# Altium schematic sheet TPS40057.SchDoc
size A3
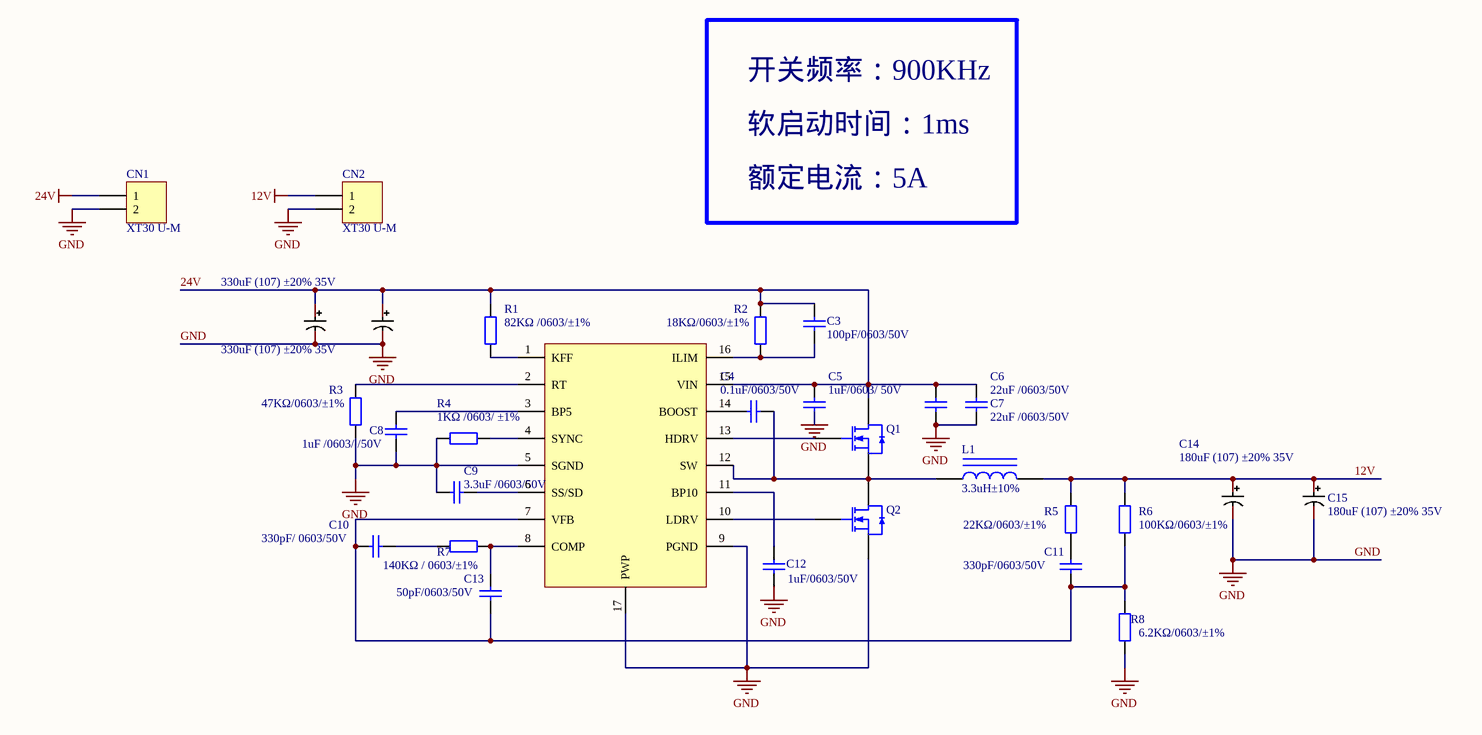
[diagram p0: TPS40057.SchDoc]

## Parts
C1  330uF (107) ±20% 35V  [CAP-SMD_BD10.0-L10.3-W10.3-LS11.3-FD]
C2  330uF (107) ±20% 35V  [CAP-SMD_BD10.0-L10.3-W10.3-LS11.3-FD]
C3  100pF/0603/50V  [0603_C]
C4  0.1uF/0603/50V  [0603_C]
C5  1uF/0603/ 50V  [0603_C]
C6  22uF /0603/50V  [0603_C]
C7  22uF /0603/50V  [0603_C]
C8  1uF /0603/ /50V  [0603_C]
C9  3.3uF /0603/50V  [0603_C]
C10  330pF/ 0603/50V  [0603_C]
C11  330pF/0603/50V  [0603_C]
C12  1uF/0603/50V  [0603_C]
C13  50pF/0603/50V  [0603_C]
C14  180uF (107) ±20% 35V  [CAP-SMD_BD8.0-L8.3-W8.3-FD]
C15  180uF (107) ±20% 35V  [CAP-SMD_BD8.0-L8.3-W8.3-FD]
CN1  XT30 U-M  [CONN-TH_XT30U-M]
CN2  XT30 U-M  [CONN-TH_XT30U-M]
L1  3.3uH±10%  [IND-SMD_L7.0-W6.6]
Q1  ST3422A N道沟 SOT-23  [SOT-23-3_L2.9-W1.6-P1.90-LS2.8-BR]  (value not drawn)
Q2  ST3422A N道沟 SOT-23  [SOT-23-3_L2.9-W1.6-P1.90-LS2.8-BR]  (value not drawn)
R1  82KΩ /0603/±1%  [0603_R]
R2  18KΩ/0603/±1%  [0603_R]
R3  47KΩ/0603/±1%  [0603_R]
R4  1KΩ /0603/ ±1%  [0603_R]
R5  22KΩ/0603/±1%  [0603_R]
R6  100KΩ/0603/±1%  [0603_R]
R7  140KΩ / 0603/±1%  [0603_R]
R8  6.2KΩ/0603/±1%  [0603_R]
U1  TPS40057PWP  [TSSOP-16_L5.0-W4.4-P0.65-LS6.4-BL-EP]  (value not drawn)

## Nets
12V: C14.1 C15.1 CN2.1 L1.2 R5.2 R6.2
24V: C1.1 C2.1 C3.2 C5.2 C6.2 C7.2 CN1.1 Q1.3(D) R1.2 R2.2 U1.15(VIN)
GND: C1.2 C2.2 C5.1 C6.1 C7.1 C8.1 C9.2 C12.1 C14.2 C15.2 CN1.2 CN2.2 Q2.2(S) R3.1 R4.2 R8.1 U1.5(SGND) U1.9(PGND) U1.17(PWP)
NetC3_1: C3.1 R2.1 U1.16(ILIM)
NetC4_1: C4.1 L1.1 Q1.2(S) Q2.3(D) U1.12(SW)
NetC4_2: C4.2 U1.14(BOOST)
NetC8_2: C8.2 U1.3(BP5)
NetC9_1: C9.1 U1.6(SS/SD)
NetC10_1: C10.1 R7.2
NetC10_2: C10.2 C11.1 C13.1 R6.1 R8.2 U1.7(VFB)
NetC11_2: C11.2 R5.1
NetC12_2: C12.2 U1.11(BP10)
NetC13_2: C13.2 R7.1 U1.8(COMP)
NetQ1_1: Q1.1(G) U1.13(HDRV)
NetQ2_1: Q2.1(G) U1.10(LDRV)
NetR1_1: R1.1 U1.1(KFF)
NetR3_2: R3.2 U1.2(RT)
NetR4_1: R4.1 U1.4(SYNC)

## Notes on the sheet
- 开关频率：900KHz
- 软启动时间：1ms
- 额定电流：5A

## Library data of the parts
C1 C2 = 330uF (107) ±20% 35V: 电解电容; Manufacturer: ROQANG(容强); Symbol: RVT1V331M1010-C72510; Device: RVT1V331M1010; Add into BOM: yes; φD: 10mm; L: 10.2mm; Lifetime @ Temp: 2000hrs@105℃; Name: 330uF; LCSC Part Name: 330uF ±20% 35V; Supplier Part: C72510; Manufacturer Part: RVT1V331M1010; Supplier Footprint: SMD,D10xL10.2mm; JLCPCB Part Class: Extended Part; Datasheet: https://atta.szlcsc.com/upload/public/pdf/source/20170217/1487312292321.pdf; Supplier: LCSC; Convert to PCB: yes; Value: 330uF; Tolerance: ±20%; Rated Voltage: 35V; Ripple Current: -; Equivalent Series Resistance(ESR): -; Operating Temperature: -45℃~+105℃
C3-C13 = 0603 22pF (220) 5% 50V: 贴片电容; ComponentLink1Description: 供应商链接; ComponentLink1URL: http://www.szlcsc.com/product/details_2005.html; Package: 0603; Supplier: LC; SuppliersPartNumber: C1653
C14 C15 = 180uF (107) ±20% 35V: 电解电容
CN1 CN2 = XT30 U-M: 模型插头轻量版锂电池插头
L1 = 0805 3.3uH10%: 贴片电感; ComponentLink1Description: 供应商链接; ComponentLink1URL: http://www.szlcsc.com/product/details_52738.html; Package: 0805; Supplier: LC; SuppliersPartNumber: C51725
Q1 Q2 = ST3422A N道沟  SOT-23: MOS(场效应管); ComponentLink1Description: 供应商链接; ComponentLink1URL: http://www.szlcsc.com/product/details_21629.html; Package: SOT-23; Supplier: LC; SuppliersPartNumber: C20917
R1-R8 = 0603 10KΩ (1002) 1%_1: 贴片电阻; ComponentLink1Description: 供应商链接; ComponentLink1URL: http://www.szlcsc.com/product/details_26547.html; Package: 0603; Supplier: LC; SuppliersPartNumber: C25804
U1 = TPS40057PWPR: 电源IC; Manufacturer: TI(德州仪器); Add into BOM: yes; Function: 降压型; Number of Outputs: 1; Input Voltage: 8V~40V; Synchronous Rectification: 是; Topology: 降压式; Switching Frequency: 1MHz; Duty Cycle (Max): 94%; Name: TPS40057PWP; Symbol: TPS40057PWP; Device: TPS40057PWP; LCSC Part Name: 降压型 8V~40V 1MHz; Supplier Part: C1529919; Manufacturer Part: TPS40057PWP; Supplier Footprint: TSSOP-16-EP; JLCPCB Part Class: Extended Part; Datasheet: https://www.ti.com/cn/lit/gpn/tps40054; Supplier: LCSC; Convert to PCB: yes; Operating Temperature: -40℃~+85℃@(TA)